# EAGLE design ZedImgBoard2 (EAGLE 6.5.0)
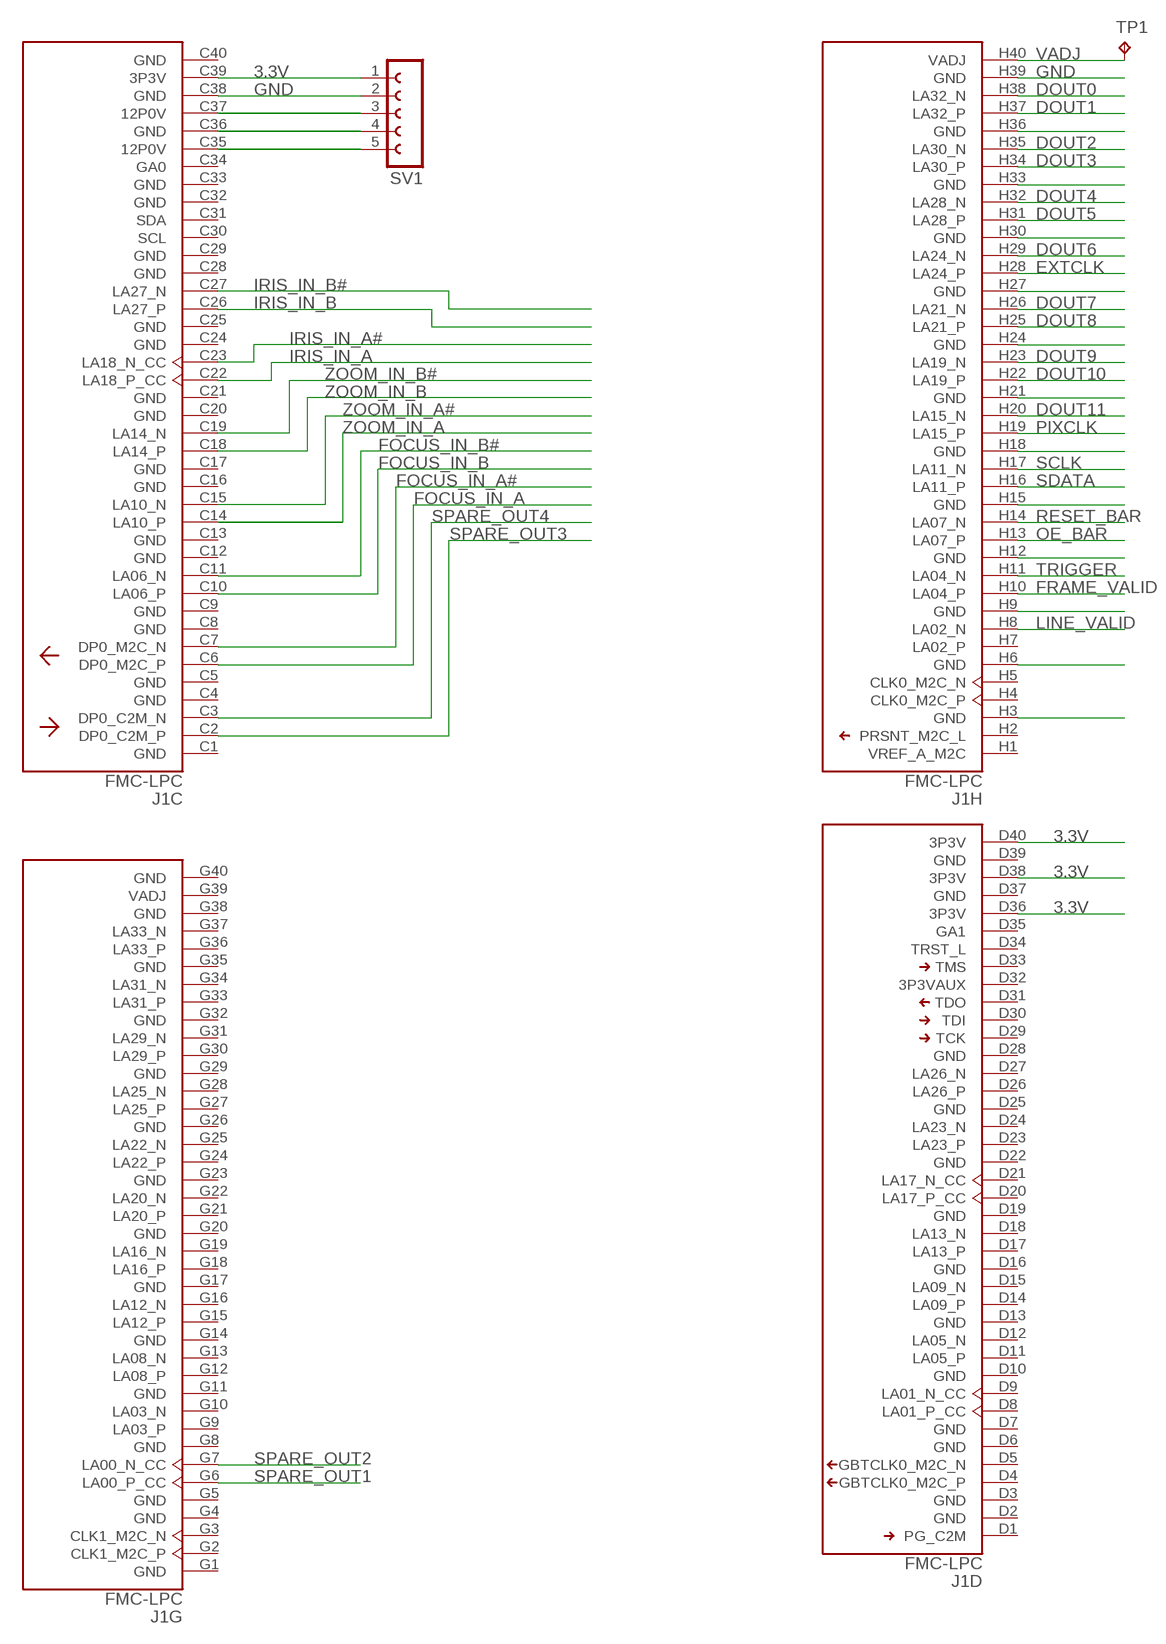
[diagram p0: schematic, sheet 1, part 1 of 2]
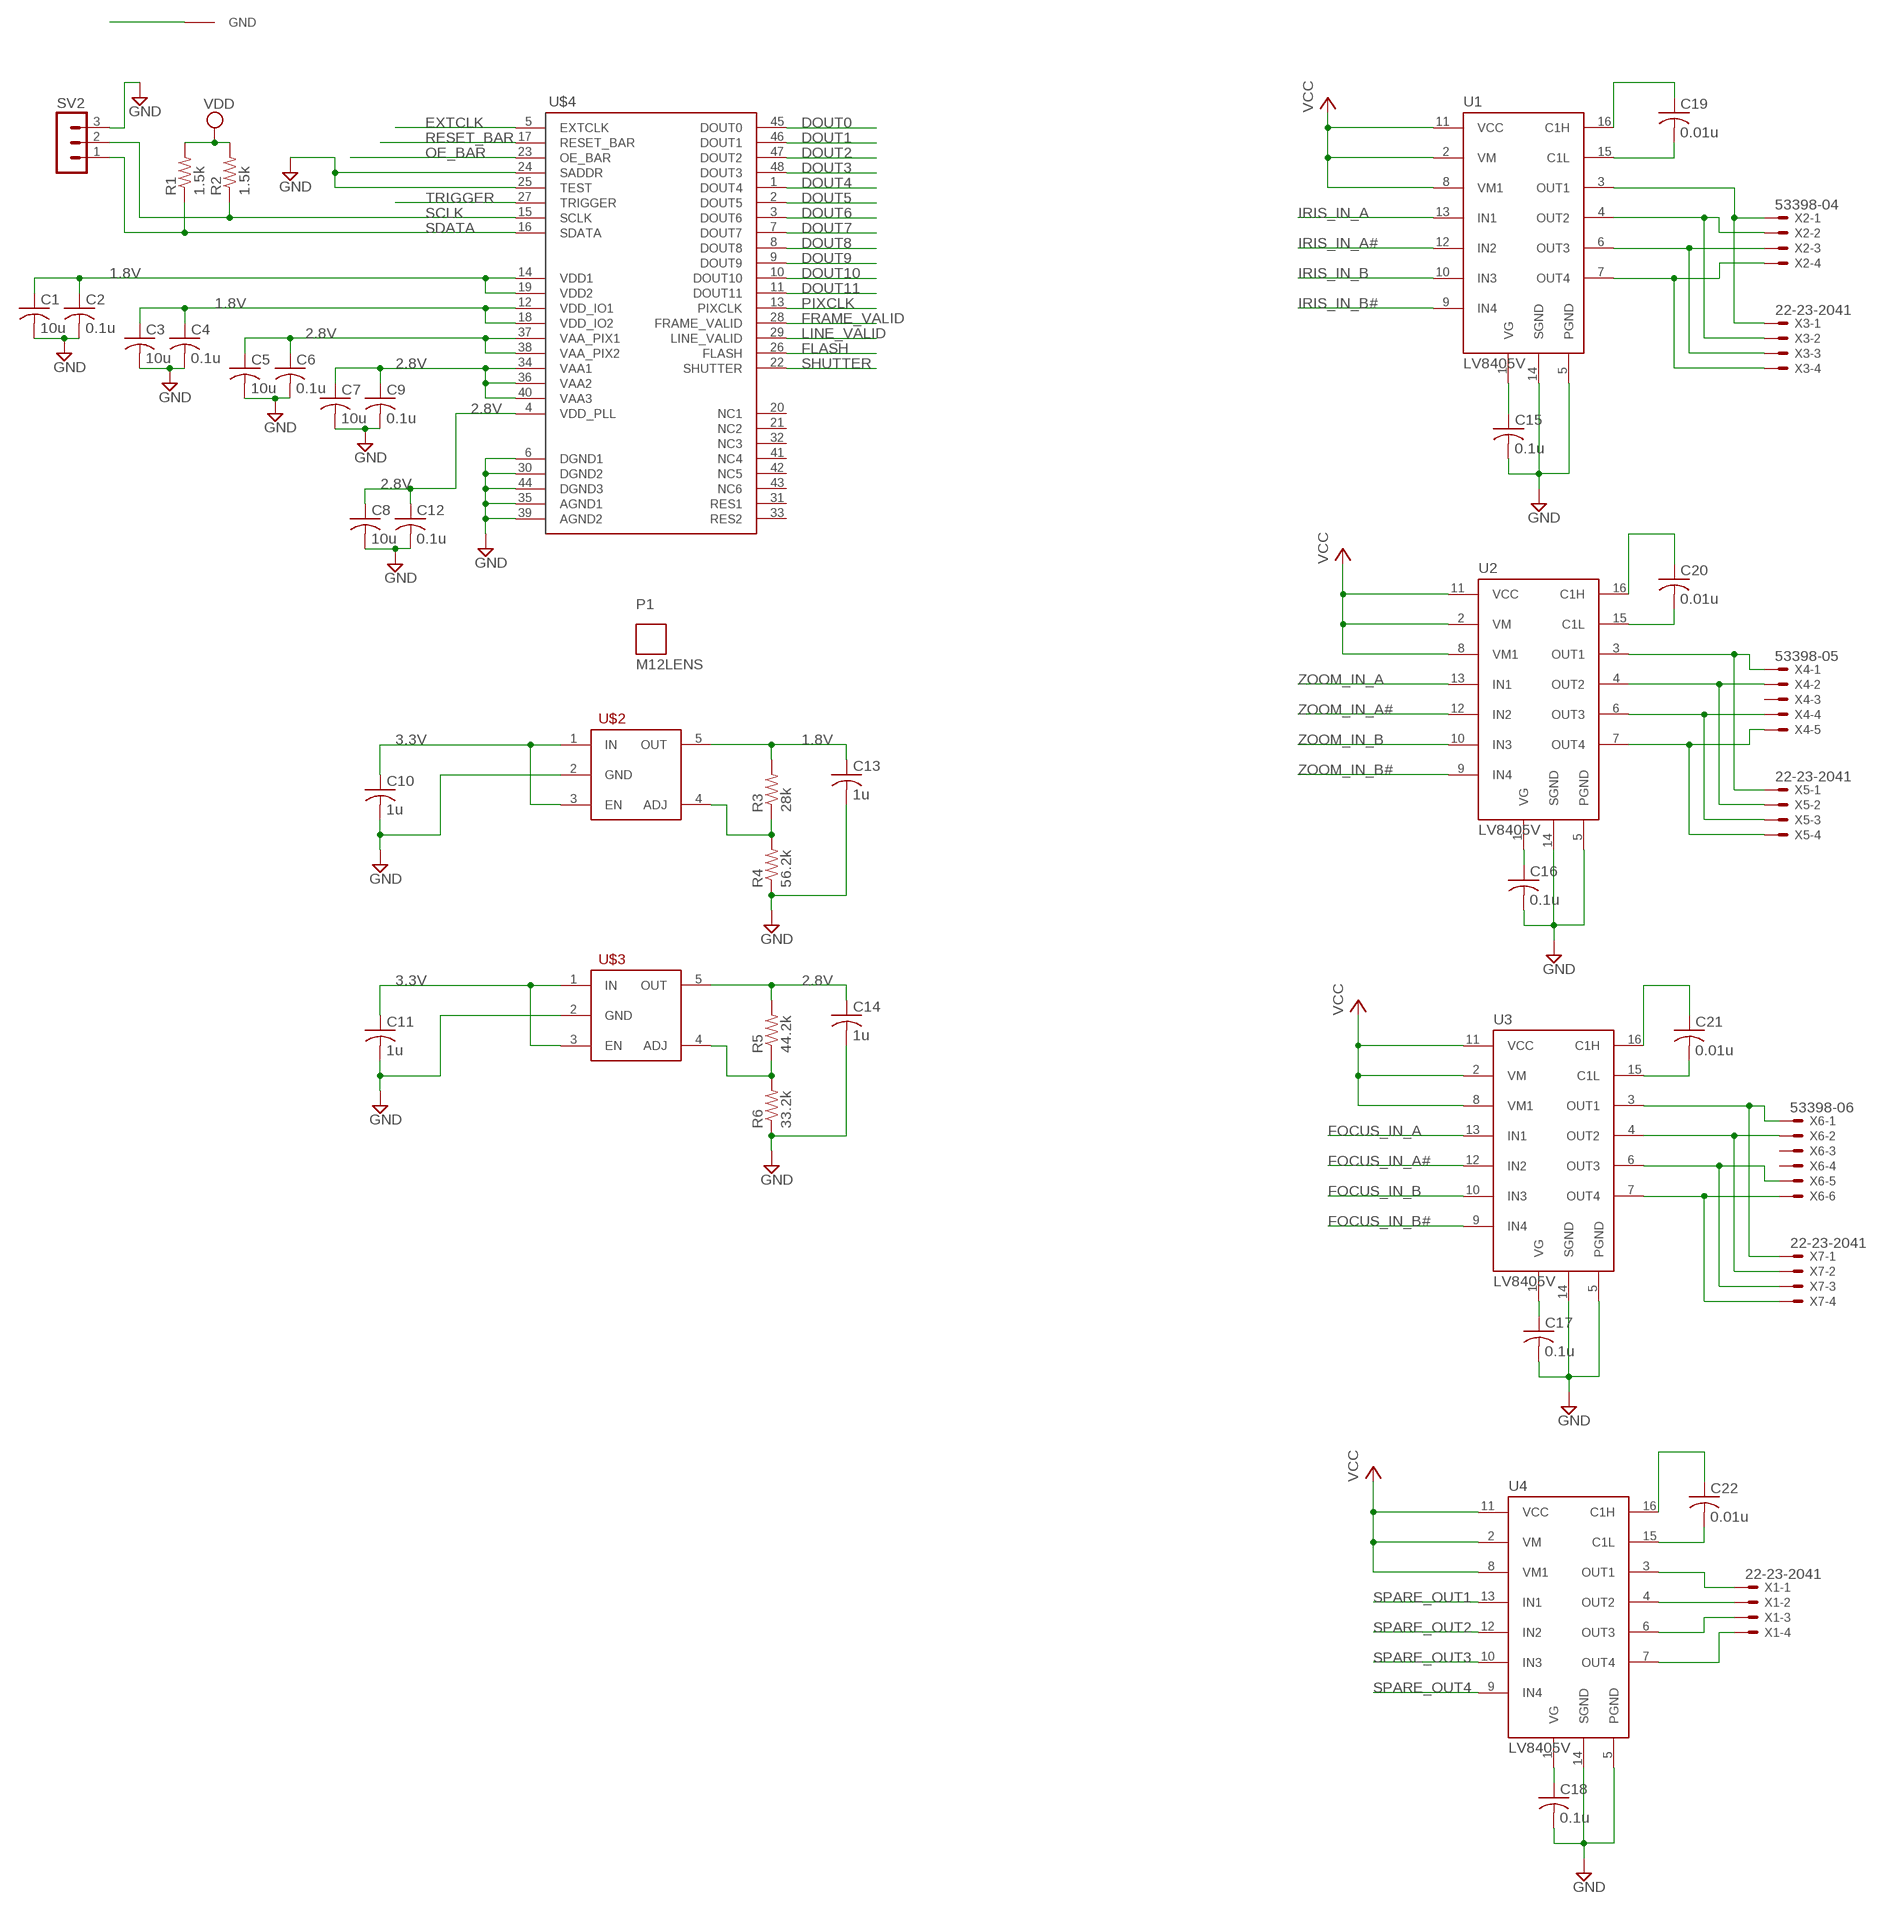
[diagram p1: schematic, sheet 1, part 2 of 2]

## Parts
C1  10u  C-USC0805  [C0805]
C2  0.1u  C-USC0805  [C0805]
C3  10u  C-USC0805  [C0805]
C4  0.1u  C-USC0805  [C0805]
C5  10u  C-USC0805  [C0805]
C6  0.1u  C-USC0805  [C0805]
C7  10u  C-USC0805  [C0805]
C8  10u  C-USC0805  [C0805]
C9  0.1u  C-USC0805  [C0805]
C10  1u  C-USC0805  [C0805]
C11  1u  C-USC0805  [C0805]
C12  0.1u  C-USC0805  [C0805]
C13  1u  C-USC0805  [C0805]
C14  1u  C-USC0805  [C0805]
C15  0.1u  C-USC0805  [C0805]
C16  0.1u  C-USC0805  [C0805]
C17  0.1u  C-USC0805  [C0805]
C18  0.1u  C-USC0805  [C0805]
C19  0.01u  C-USC0805  [C0805]
C20  0.01u  C-USC0805  [C0805]
C21  0.01u  C-USC0805  [C0805]
C22  0.01u  C-USC0805  [C0805]
J1  FMC-LPC  [FMC-LPC-MALE]
P1  M12LENS  [M12LENS]
R1  1.5k  R-US_M0805  [M0805]
R2  1.5k  R-US_M0805  [M0805]
R3  28k  R-US_M0805  [M0805]
R4  56.2k  R-US_M0805  [M0805]
R5  44.2k  R-US_M0805  [M0805]
R6  33.2k  R-US_M0805  [M0805]
SV1  FE05-1  [FE05-1]
SV2  MA03-1  [MA03-1]
TP1  TPB1,27  [B1,27]
U1  LV8405V  [SSOP16]
U2  LV8405V  [SSOP16]
U3  LV8405V  [SSOP16]
U4  LV8405V  [SSOP16]
U$1  GND_LUG  [GND_PAD]
U$2  TPS73201DB  [SOT23-5]
U$3  TPS73201DB  [SOT23-5]
U$4  AR0331  [ILCC48]
X1  22-23-2041  [22-23-2041]
X2  53398-04  [53398-04]
X3  22-23-2041  [22-23-2041]
X4  53398-05  [53398-05]
X5  22-23-2041  [22-23-2041]
X6  53398-06  [53398-06]
X7  22-23-2041  [22-23-2041]

## Nets
1.8V: C1.1 C2.1 C3.1 C4.1 C13.1 R1.2 R2.2 R3.2 U$2.5(OUT) U$4.12(VDD_IO1) U$4.14(VDD1) U$4.18(VDD_IO2) U$4.19(VDD2) ; supply symbol labelled VDD
2.8V: C5.1 C6.1 C7.1 C8.1 C9.1 C12.1 C14.1 R5.2 U$3.5(OUT) U$4.4(VDD_PLL) U$4.34(VAA1) U$4.36(VAA2) U$4.37(VAA_PIX1) U$4.38(VAA_PIX2) U$4.40(VAA3)
3.3V: C10.1 C11.1 J1.C39(C:3P3V) J1.D36(D:3P3V) J1.D38(D:3P3V) J1.D40(D:3P3V) SV1.1 U1.2(VM) U1.8(VM1) U1.11(VCC) U2.2(VM) U2.8(VM1) U2.11(VCC) U3.2(VM) U3.8(VM1) U3.11(VCC) U4.2(VM) U4.8(VM1) U4.11(VCC) U$2.1(IN) U$2.3(EN) U$3.1(IN) U$3.3(EN) ; supply symbol labelled VCC
DOUT0: J1.H38(H:LA32_N) U$4.45(DOUT0)
DOUT1: J1.H37(H:LA32_P) U$4.46(DOUT1)
DOUT2: J1.H35(H:LA30_N) U$4.47(DOUT2)
DOUT3: J1.H34(H:LA30_P) U$4.48(DOUT3)
DOUT4: J1.H32(H:LA28_N) U$4.1(DOUT4)
DOUT5: J1.H31(H:LA28_P) U$4.2(DOUT5)
DOUT6: J1.H29(H:LA24_N) U$4.3(DOUT6)
DOUT7: J1.H26(H:LA21_N) U$4.7(DOUT7)
DOUT8: J1.H25(H:LA21_P) U$4.8(DOUT8)
DOUT9: J1.H23(H:LA19_N) U$4.9(DOUT9)
DOUT10: J1.H22(H:LA19_P) U$4.10(DOUT10)
DOUT11: J1.H20(H:LA15_N) U$4.11(DOUT11)
EXTCLK: J1.H28(H:LA24_P) U$4.5(EXTCLK)
FLASH: U$4.26(FLASH)
FOCUS_IN_A: J1.C6(C:DP0_M2C_P) U3.13(IN1)
FOCUS_IN_A#: J1.C7(C:DP0_M2C_N) U3.12(IN2)
FOCUS_IN_B: J1.C10(C:LA06_P) U3.10(IN3)
FOCUS_IN_B#: J1.C11(C:LA06_N) U3.9(IN4)
FRAME_VALID: J1.H10(H:LA04_P) U$4.28(FRAME_VALID)
GND: C1.2 C2.2 C3.2 C4.2 C5.2 C6.2 C7.2 C8.2 C9.2 C10.2 C11.2 C12.2 C13.2 C14.2 C15.2 C16.2 C17.2 C18.2 J1.C38(C:GND) J1.H3(H:GND) J1.H6(H:GND) J1.H9(H:GND) J1.H12(H:GND) J1.H15(H:GND) J1.H18(H:GND) J1.H21(H:GND) J1.H24(H:GND) J1.H27(H:GND) J1.H30(H:GND) J1.H33(H:GND) J1.H36(H:GND) J1.H39(H:GND) R4.1 R6.1 SV1.2 SV2.3 U1.5(PGND) U1.14(SGND) U2.5(PGND) U2.14(SGND) U3.5(PGND) U3.14(SGND) U4.5(PGND) U4.14(SGND) U$1.P$1(GND) U$2.2(GND) U$3.2(GND) U$4.6(DGND1) U$4.24(SADDR) U$4.25(TEST) U$4.30(DGND2) U$4.35(AGND1) U$4.39(AGND2) U$4.44(DGND3)
IRIS_IN_A: J1.C22(C:LA18_P_CC) U1.13(IN1)
IRIS_IN_A#: J1.C23(C:LA18_N_CC) U1.12(IN2)
IRIS_IN_B: J1.C26(C:LA27_P) U1.10(IN3)
IRIS_IN_B#: J1.C27(C:LA27_N) U1.9(IN4)
LINE_VALID: J1.H8(H:LA02_N) U$4.29(LINE_VALID)
N$1: U1.3(OUT1) X2.1 X3.1
N$2: U1.4(OUT2) X2.2 X3.2
N$3: U1.6(OUT3) X2.3 X3.3
N$4: U2.3(OUT1) X4.1 X5.1
N$5: U2.4(OUT2) X4.2 X5.2
N$6: U2.6(OUT3) X4.4 X5.3
N$7: U2.7(OUT4) X4.5 X5.4
N$8: U3.3(OUT1) X6.1 X7.1
N$9: U3.4(OUT2) X6.2 X7.2
N$10: U3.6(OUT3) X6.5 X7.3
N$11: U3.7(OUT4) X6.6 X7.4
N$15: C19.2 U1.15(C1L)
N$16: C19.1 U1.16(C1H)
N$17: C15.1 U1.1(VG)
N$18: C20.2 U2.15(C1L)
N$19: C20.1 U2.16(C1H)
N$20: C16.1 U2.1(VG)
N$21: C21.2 U3.15(C1L)
N$22: C21.1 U3.16(C1H)
N$23: C17.1 U3.1(VG)
N$27: U1.7(OUT4) X2.4 X3.4
N$29: C22.2 U4.15(C1L)
N$36: C22.1 U4.16(C1H)
N$37: R3.1 R4.2 U$2.4(ADJ)
N$38: J1.C37(C:12P0V) SV1.3
N$39: J1.C36(C:GND) SV1.4
N$40: R5.1 R6.2 U$3.4(ADJ)
N$41: J1.C35(C:12P0V) SV1.5
N$46: C18.1 U4.1(VG)
N$47: U4.3(OUT1) X1.1
N$48: U4.4(OUT2) X1.2
N$49: U4.6(OUT3) X1.3
N$50: U4.7(OUT4) X1.4
OE_BAR: J1.H13(H:LA07_P) U$4.23(OE_BAR)
PIXCLK: J1.H19(H:LA15_P) U$4.13(PIXCLK)
RESET_BAR: J1.H14(H:LA07_N) U$4.17(RESET_BAR)
SCLK: J1.H17(H:LA11_N) R2.1 SV2.2 U$4.15(SCLK)
SDATA: J1.H16(H:LA11_P) R1.1 SV2.1 U$4.16(SDATA)
SHUTTER: U$4.22(SHUTTER)
SPARE_OUT1: J1.G6(G:LA00_P_CC) U4.13(IN1)
SPARE_OUT2: J1.G7(G:LA00_N_CC) U4.12(IN2)
SPARE_OUT3: J1.C2(C:DP0_C2M_P) U4.10(IN3)
SPARE_OUT4: J1.C3(C:DP0_C2M_N) U4.9(IN4)
TRIGGER: J1.H11(H:LA04_N) U$4.27(TRIGGER)
VADJ: J1.H40(H:VADJ) TP1.TP
ZOOM_IN_A: J1.C14(C:LA10_P) U2.13(IN1)
ZOOM_IN_A#: J1.C15(C:LA10_N) U2.12(IN2)
ZOOM_IN_B: J1.C18(C:LA14_P) U2.10(IN3)
ZOOM_IN_B#: J1.C19(C:LA14_N) U2.9(IN4)
Unconnected: J1.C1(C:GND) J1.C4(C:GND) J1.C5(C:GND) J1.C8(C:GND) J1.C9(C:GND) J1.C12(C:GND) J1.C13(C:GND) J1.C16(C:GND) J1.C17(C:GND) J1.C20(C:GND) J1.C21(C:GND) J1.C24(C:GND) J1.C25(C:GND) J1.C28(C:GND) J1.C29(C:GND) J1.C30(C:SCL) J1.C31(C:SDA) J1.C32(C:GND) J1.C33(C:GND) J1.C34(C:GA0) J1.C40(C:GND) J1.D1(D:PG_C2M) J1.D2(D:GND) J1.D3(D:GND) J1.D4(D:GBTCLK0_M2C_P) J1.D5(D:GBTCLK0_M2C_N) J1.D6(D:GND) J1.D7(D:GND) J1.D8(D:LA01_P_CC) J1.D9(D:LA01_N_CC) J1.D10(D:GND) J1.D11(D:LA05_P) J1.D12(D:LA05_N) J1.D13(D:GND) J1.D14(D:LA09_P) J1.D15(D:LA09_N) J1.D16(D:GND) J1.D17(D:LA13_P) J1.D18(D:LA13_N) J1.D19(D:GND) J1.D20(D:LA17_P_CC) J1.D21(D:LA17_N_CC) J1.D22(D:GND) J1.D23(D:LA23_P) J1.D24(D:LA23_N) J1.D25(D:GND) J1.D26(D:LA26_P) J1.D27(D:LA26_N) J1.D28(D:GND) J1.D29(D:TCK) J1.D30(D:TDI) J1.D31(D:TDO) J1.D32(D:3P3VAUX) J1.D33(D:TMS) J1.D34(D:TRST_L) J1.D35(D:GA1) J1.D37(D:GND) J1.D39(D:GND) J1.G1(G:GND) J1.G2(G:CLK1_M2C_P) J1.G3(G:CLK1_M2C_N) J1.G4(G:GND) J1.G5(G:GND) J1.G8(G:GND) J1.G9(G:LA03_P) J1.G10(G:LA03_N) J1.G11(G:GND) J1.G12(G:LA08_P) J1.G13(G:LA08_N) J1.G14(G:GND) J1.G15(G:LA12_P) J1.G16(G:LA12_N) J1.G17(G:GND) J1.G18(G:LA16_P) J1.G19(G:LA16_N) J1.G20(G:GND) J1.G21(G:LA20_P) J1.G22(G:LA20_N) J1.G23(G:GND) J1.G24(G:LA22_P) J1.G25(G:LA22_N) J1.G26(G:GND) J1.G27(G:LA25_P) J1.G28(G:LA25_N) J1.G29(G:GND) J1.G30(G:LA29_P) J1.G31(G:LA29_N) J1.G32(G:GND) J1.G33(G:LA31_P) J1.G34(G:LA31_N) J1.G35(G:GND) J1.G36(G:LA33_P) J1.G37(G:LA33_N) J1.G38(G:GND) J1.G39(G:VADJ) J1.G40(G:GND) J1.H1(H:VREF_A_M2C) J1.H2(H:PRSNT_M2C_L) J1.H4(H:CLK0_M2C_P) J1.H5(H:CLK0_M2C_N) J1.H7(H:LA02_P) U$4.20(NC1) U$4.21(NC2) U$4.31(RES1) U$4.32(NC3) U$4.33(RES2) U$4.41(NC4) U$4.42(NC5) U$4.43(NC6) X4.3 X6.3 X6.4

## Library data of the parts
C1-C22 = resistor:C-US: CAPACITOR, American symbol
J1 = dan-xilinx:FMC-LPC: FMC-LPC Bottom side connector for interfacing with Xilinx FPGA development boards (e.g. SP605); OC_NEWARK: unknown
P1 = NicksParts:M12LENS
R1-R6 = resistor:R-US_: RESISTOR, American symbol
SV1 = con-lsta:FE05-1: FEMALE HEADER; OC_FARNELL: unknown; OC_NEWARK: unknown
SV2 = con-lstb:MA03-1: PIN HEADER; OC_FARNELL: unknown; OC_NEWARK: unknown
TP1 = testpad:TP: Test pad
U1-U4 = NicksParts:LV8405V
U$1 = NicksParts:GND_LUG
U$2 U$3 = NicksParts:TPS73201DB
U$4 = NicksParts:AR0331
X1 X3 X5 X7 = con-molex:22-23-2041: .100" (2.54mm) Center Header - 4 Pin; MF: MOLEX; MPN: 22-23-2041; OC_FARNELL: 1462920; OC_NEWARK: 38C0355
X2 = con-molex:53?-04: CONNECTOR wire to board 1.25 mm (.049 inch) pitch header; OC_FARNELL: 1125367; OC_NEWARK: unknown
X4 = con-molex:53?-05: CONNECTOR wire to board 1.25 mm (.049 inch) pitch header; OC_FARNELL: 1125354; OC_NEWARK: unknown
X6 = con-molex:53?-06: CONNECTOR wire to board 1.25 mm (.049 inch) pitch header; OC_FARNELL: 1125368; OC_NEWARK: unknown

## Board
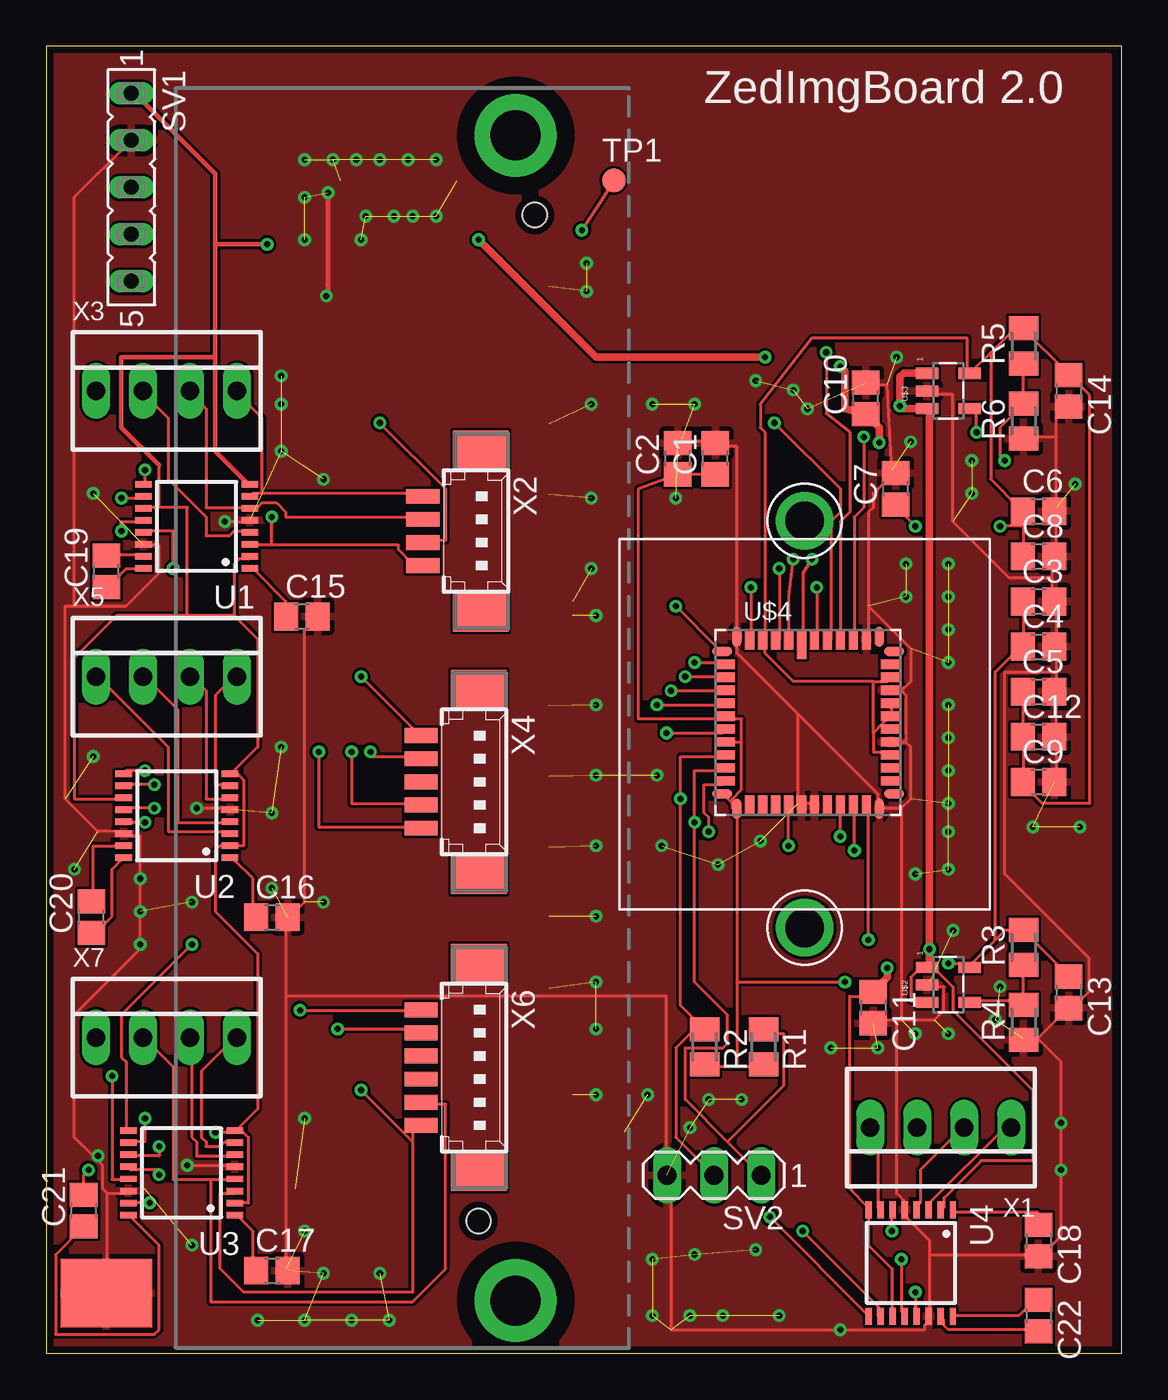
[diagram p2: board, top side]
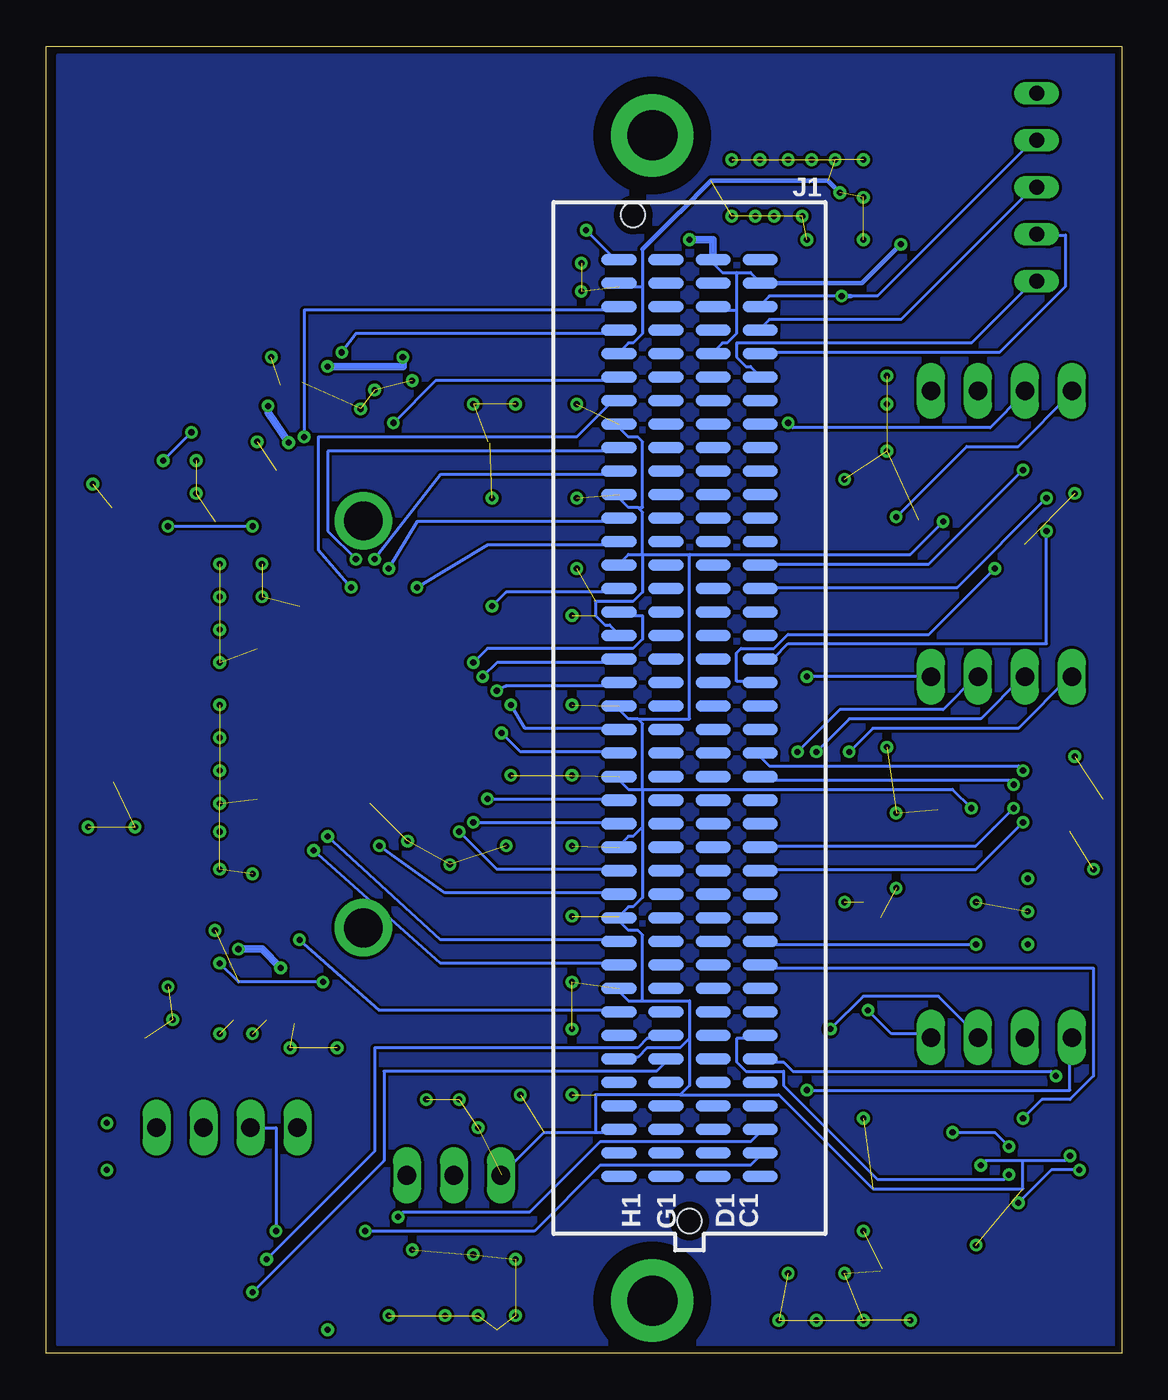
[diagram p3: board, bottom side, seen from below]

Size 58.14 x 70.65 mm. Coordinates in mm from the lower left corner, seen from the top.
Outline: 0,0 58.14,0 58.14,70.65 0,70.65 0,0
Copper layers (1*16): Top 0.0356mm / dielectric 1.5011mm / Bottom 0.0356mm
Design rules "LaenPCBOrder": minimum track width 6mil, minimum drill 13mil, track to track 6mil, track to pad 6mil, pad to pad 6mil, via to via 6mil, smd to smd 6mil, copper to edge 15mil, drill to drill 6mil, minimum pad ring 7mil, minimum via ring 7mil, stop-mask expansion 3mil, vias tented up to drill 0mil, thermal gap 10mil

### Footprints (pad centres in the part's own frame; a part is rotated, then mirrored left to right if it is on the bottom)
C0805 = smd 1.3 x 1.5: 1 -0.85,0; 2 0.85,0
FMC-LPC-MALE = smd 1.905 x 0.635 bottom: C1 -3.81,-24.765; C2 -3.81,-23.495; C3 -3.81,-22.225; C4 -3.81,-20.955; C5 -3.81,-19.685; C6 -3.81,-18.415; C7 -3.81,-17.145; C8 -3.81,-15.875; C9 -3.81,-14.605; C10 -3.81,-13.335; C11 -3.81,-12.065; C12 -3.81,-10.795; C13 -3.81,-9.525; C14 -3.81,-8.255; C15 -3.81,-6.985; C16 -3.81,-5.715; C17 -3.81,-4.445; C18 -3.81,-3.175; C19 -3.81,-1.905; C20 -3.81,-0.635; C21 -3.81,0.635; C22 -3.81,1.905; C23 -3.81,3.175; C24 -3.81,4.445; C25 -3.81,5.715; C26 -3.81,6.985; C27 -3.81,8.255; C28 -3.81,9.525; C29 -3.81,10.795; C30 -3.81,12.065; C31 -3.81,13.335; C32 -3.81,14.605; C33 -3.81,15.875; C34 -3.81,17.145; C35 -3.81,18.415; C36 -3.81,19.685; C37 -3.81,20.955; C38 -3.81,22.225; C39 -3.81,23.495; C40 -3.81,24.765; D1 -1.27,-24.765; D2 -1.27,-23.495; D3 -1.27,-22.225; D4 -1.27,-20.955; D5 -1.27,-19.685; D6 -1.27,-18.415; D7 -1.27,-17.145; D8 -1.27,-15.875; D9 -1.27,-14.605; D10 -1.27,-13.335; D11 -1.27,-12.065; D12 -1.27,-10.795; D13 -1.27,-9.525; D14 -1.27,-8.255; D15 -1.27,-6.985; D16 -1.27,-5.715; D17 -1.27,-4.445; D18 -1.27,-3.175; D19 -1.27,-1.905; D20 -1.27,-0.635; D21 -1.27,0.635; D22 -1.27,1.905; D23 -1.27,3.175; D24 -1.27,4.445; D25 -1.27,5.715; D26 -1.27,6.985; D27 -1.27,8.255; D28 -1.27,9.525; D29 -1.27,10.795; D30 -1.27,12.065; D31 -1.27,13.335; D32 -1.27,14.605; D33 -1.27,15.875; D34 -1.27,17.145; D35 -1.27,18.415; D36 -1.27,19.685; D37 -1.27,20.955; D38 -1.27,22.225; D39 -1.27,23.495; D40 -1.27,24.765; G1 1.27,-24.765; G2 1.27,-23.495; G3 1.27,-22.225; G4 1.27,-20.955; G5 1.27,-19.685; G6 1.27,-18.415; G7 1.27,-17.145; G8 1.27,-15.875; G9 1.27,-14.605; G10 1.27,-13.335; G11 1.27,-12.065; G12 1.27,-10.795; G13 1.27,-9.525; G14 1.27,-8.255; G15 1.27,-6.985; G16 1.27,-5.715; G17 1.27,-4.445; G18 1.27,-3.175; G19 1.27,-1.905; G20 1.27,-0.635; G21 1.27,0.635; G22 1.27,1.905; G23 1.27,3.175; G24 1.27,4.445; G25 1.27,5.715; G26 1.27,6.985; G27 1.27,8.255; G28 1.27,9.525; G29 1.27,10.795; G30 1.27,12.065; G31 1.27,13.335; G32 1.27,14.605; G33 1.27,15.875; G34 1.27,17.145; G35 1.27,18.415; G36 1.27,19.685; G37 1.27,20.955; G38 1.27,22.225; G39 1.27,23.495; G40 1.27,24.765; H1 3.81,-24.765; H2 3.81,-23.495; H3 3.81,-22.225; H4 3.81,-20.955; H5 3.81,-19.685; H6 3.81,-18.415; H7 3.81,-17.145; H8 3.81,-15.875; H9 3.81,-14.605; H10 3.81,-13.335; H11 3.81,-12.065; H12 3.81,-10.795; H13 3.81,-9.525; H14 3.81,-8.255; H15 3.81,-6.985; H16 3.81,-5.715; H17 3.81,-4.445; H18 3.81,-3.175; H19 3.81,-1.905; H20 3.81,-0.635; H21 3.81,0.635; H22 3.81,1.905; H23 3.81,3.175; H24 3.81,4.445; H25 3.81,5.715; H26 3.81,6.985; H27 3.81,8.255; H28 3.81,9.525; H29 3.81,10.795; H30 3.81,12.065; H31 3.81,13.335; H32 3.81,14.605; H33 3.81,15.875; H34 3.81,17.145; H35 3.81,18.415; H36 3.81,19.685; H37 3.81,20.955; H38 3.81,22.225; H39 3.81,23.495; H40 3.81,24.765 | drill 2.692 pad 4.445: M1 2.007,31.496; M2 2.007,-31.496 | hole 1.321: 0,-27.191; 3.048,27.191
M12LENS = drill 2.1 pad 3: P$1 11,0; P$3 -11,0
M0805 = smd 1.3 x 1.6: 1 -0.95,0; 2 0.95,0
FE05-1 = drill 0.813 long: 1 -5.08,0; 2 -2.54,0; 3 0,0; 4 2.54,0; 5 5.08,0
MA03-1 = drill 1.016 long: 1 -2.54,0; 2 0,0; 3 2.54,0
B1,27 = smd 1.27 x 1.27: TP 0,0
SSOP16 = smd 0.9 x 0.35: 1 -2.875,2.275; 2 -2.875,1.625; 3 -2.875,0.975; 4 -2.875,0.325; 5 -2.875,-0.325; 6 -2.875,-0.975; 7 -2.875,-1.625; 8 -2.875,-2.275; 9 2.875,-2.275; 10 2.875,-1.625; 11 2.875,-0.975; 12 2.875,-0.325; 13 2.875,0.325; 14 2.875,0.975; 15 2.875,1.625; 16 2.875,2.275
GND_PAD = smd 4.953 x 3.683: P$1 0,0
SOT23-5 = smd 0.6 x 1.2: 1 0.95,1.15; 2 0,1.15; 3 -0.95,1.15; 4 -0.95,-1.15; 5 0.95,-1.15
ILCC48 = smd 0.5 x 1.6: 1 -0.35,4.25 | smd 0.5 x 1.1: 2 -1.05,4.5; 3 -1.75,4.5; 4 -2.45,4.5; 5 -3.15,4.5; 6 -3.85,4.65; 19 -3.85,-4.65; 20 -3.15,-4.5; 21 -2.45,-4.5; 22 -1.75,-4.5; 23 -1.05,-4.5; 24 -0.35,-4.5; 25 0.35,-4.5; 26 1.05,-4.5; 27 1.75,-4.5; 28 2.45,-4.5; 29 3.15,-4.5; 30 3.85,-4.65; 43 3.85,4.65; 44 3.15,4.5; 45 2.45,4.5; 46 1.75,4.5; 47 1.05,4.5; 48 0.35,4.5 | smd 1.1 x 0.5: 7 -4.65,3.85; 8 -4.5,3.15; 9 -4.5,2.45; 10 -4.5,1.75; 11 -4.5,1.05; 12 -4.5,0.35; 13 -4.5,-0.35; 14 -4.5,-1.05; 15 -4.5,-1.75; 16 -4.5,-2.45; 17 -4.5,-3.15; 18 -4.65,-3.85; 31 4.65,-3.85; 32 4.5,-3.15; 33 4.5,-2.45; 34 4.5,-1.75; 35 4.5,-1.05; 36 4.5,-0.35; 37 4.5,0.35; 38 4.5,1.05; 39 4.5,1.75; 40 4.5,2.45; 41 4.5,3.15; 42 4.65,3.85
22-23-2041 = drill 1 long: 1 -3.81,0; 2 -1.27,0; 3 1.27,0; 4 3.81,0
53398-04 = smd 0.8 x 1.8: 1 1.875,-2.5; 2 0.625,-2.5; 3 -0.625,-2.5; 4 -1.875,-2.5 | smd 2.1 x 3: S1 4.375,0.625; S2 -4.375,0.625
53398-05 = smd 0.8 x 1.8: 1 2.5,-2.5; 2 1.25,-2.5; 3 0,-2.5; 4 -1.25,-2.5; 5 -2.5,-2.5 | smd 2.1 x 3: S1 5,0.625; S2 -5,0.625
53398-06 = smd 0.8 x 1.8: 1 3.125,-2.5; 2 1.875,-2.5; 3 0.625,-2.5; 4 -0.625,-2.5; 5 -1.875,-2.5; 6 -3.125,-2.5 | smd 2.1 x 3: S1 5.625,0.625; S2 -5.625,0.625

### Placement (x,y rotation side)
C1  36.17,48.36 90 top
C2  34.14,48.36 90 top
C3  53.64,40.64 0 top
C4  53.64,38.2 0 top
C5  53.64,35.76 0 top
C6  53.64,45.52 0 top
C7  45.92,46.74 90 top
C8  53.64,43.08 0 top
C9  53.64,30.89 0 top
C10  44.3,51.61 90 top
C11  44.7,18.69 270 top
C12  53.64,33.32 0 top
C13  55.27,19.51 270 top
C14  55.27,52.02 270 top
C15  13.82,39.83 0 top
C16  12.19,23.57 0 top
C17  12.19,4.47 0 top
C18  53.64,6.1 270 top
C19  3.25,42.27 90 top
C20  2.44,23.57 90 top
C21  2.03,7.72 90 top
C22  53.64,2.03 270 top
J1  23.37,34.34 0 top
P1  41,34 90 top
R1  38.78,16.56 270 top
R2  35.59,16.56 270 top
R3  52.83,21.95 90 top
R4  52.83,17.88 90 top
R5  52.83,54.46 90 top
R6  52.83,50.39 90 top
SV1  4.6,63.03 270 top
SV2  36.1,9.62 180 top
TP1  30.68,63.4 0 top
U1  8.13,44.7 180 top
U2  7.06,29.06 180 top
U3  7.32,9.75 180 top
U4  46.74,4.88 270 top
U$1  3.25,3.25 0 top
U$2  48.77,19.91 90 top
U$3  48.77,52.02 90 top
U$4  41.18,34.09 0 top
X1  48.36,12.19 180 top
X2  22.86,44.45 270 top
X3  6.5,52.02 0 top
X4  22.76,30.89 270 top
X5  6.5,36.58 0 top
X6  22.76,15.44 270 top
X7  6.5,17.07 0 top

### Tracks (layer width: path | path; a pad name or v marks a point on that pad's centre or on a via)
1.8V  (via drill 0.33)
  Top 0.152: C3.1 52.83,40.64 52.83,38.35 C4.1 52.58,38.1 51.31,36.83 51.31,22.35 | 51.31,22.35 51.82,22.86 52.83,22.86 | 51.31,22.35 50.04,21.08 U$2.5 49.78,21.08 v48.77,21.08 | 52.83,22.86 55.12,20.57 C13.1 | 52.83,22.86 R3.2 | 37.34,15.49 38.61,15.49 R1.2 | 37.34,15.49 35.81,15.49 R2.2 | C1.1 36.07,47.5 34.29,47.5 C2.1 34.04,47.5 32,46.74 32,34.29 36.58,34.29 U$4.12 36.83,34.29 37.59,34.29 37.59,33.02 | 37.08,29.72 36.58,30.23 U$4.18 | 37.08,29.72 37.08,29.46 U$4.19 | 37.59,33.02 36.83,33.02 U$4.14 | 37.59,33.02 37.59,30.48 37.08,29.97 37.08,29.72 | 37.08,29.72 U$4.19 | 37.34,20.07 37.34,29.21 U$4.19 | 37.34,20.07 37.34,15.49 | 37.34,20.07 v43.18,20.07
  Bottom 0.152: v48.77,21.08 47.75,20.07 v43.18,20.07
2.8V  (via drill 0.33)
  Top 0.152: 44.7,33.53 44.7,32.51 45.47,32.51 U$4.34 | 45.21,34.04 45.47,34.29 U$4.37 45.72,34.54 45.72,35.05 U$4.38 | 45.21,34.04 44.7,33.53 | 45.21,34.04 45.47,33.78 U$4.36 | 44.7,36.32 45.47,36.32 U$4.40 | 44.7,33.53 44.7,36.32 | 44.7,36.32 40.39,36.32 38.86,37.85 38.86,38.35 U$4.4 38.86,38.61 38.86,49.78 38.61,50.04 38.61,51.31 41.4,54.86 49.78,54.86 49.78,53.09 U$3.5 50.04,53.09 51.05,54.1 | 52.83,44.7 52.83,45.47 C6.1 52.58,45.72 51.05,47.24 51.05,54.1 | 52.83,44.7 52.83,43.18 C8.1 | v46.99,44.7 45.97,45.72 C7.1 | 52.83,44.7 v51.56,44.7 | C5.1 52.83,35.56 52.83,33.53 C12.1 52.83,33.27 52.83,30.99 C9.1 52.83,30.73 53.85,29.72 56.39,29.72 56.39,51.82 55.37,52.83 C14.1 55.12,53.09 52.83,55.37 | 51.05,54.1 52.32,55.37 52.83,55.37 | 52.83,55.37 R5.2
  Bottom 0.152: v51.56,44.7 v46.99,44.7
3.3V  (via drill 0.33, 0.33 pad 0.25)
  Top 0.152: U4.11 45.72,2.03 45.72,4.57 44.45,5.84 44.45,7.62 U4.8 44.45,7.87 43.43,8.89 43.43,19.3 44.7,19.3 C11.1 44.7,19.56 | 47.5,51.05 U$3.3 47.75,51.05 | 47.5,52.83 U$3.1 | 44.2,50.8 C10.1 | U4.2 48.51,7.87 48.51,8.38 50.55,10.41 53.34,10.41 53.34,14.22 49.02,18.54 49.02,19.81 47.75,21.08 U$2.1 47.5,21.08 46.74,20.32 46.74,19.05 47.5,19.05 U$2.3 | 10.92,46.99 U1.8 | 4.83,68.07 SV1.1 | v6.1,11.18 6.1,10.67 4.57,10.67 U3.11 | v9.14,11.94 10.16,11.94 U3.8 10.41,12.19 | 10.41,12.19 10.92,11.68 10.92,8.13 10.41,8.13 U3.2 | 10.16,31.5 10.67,30.99 10.67,27.43 10.16,27.43 U2.2 9.91,27.43 9.4,27.43 9.14,27.18 9.14,23.88 11.43,21.59 11.43,13.21 10.41,12.19 | 10.16,39.88 7.62,39.88 | 7.62,39.88 3.81,39.88 1.52,37.59 1.52,29.97 4.06,29.97 U2.11 | 10.16,39.88 10.16,42.67 10.41,42.93 10.92,42.93 U1.2 | 6.1,45.72 7.62,45.72 7.62,39.88 | 6.1,45.72 5.33,45.72 U1.11 | 10.16,31.5 11.43,32.77 11.43,38.61 10.16,39.88 | 10.16,31.5 U2.8 | 6.1,45.72 6.1,48.01
  Top 0.254: 10.92,46.99 9.14,48.77 9.14,53.85 | 9.14,59.94 9.14,63.75 4.83,68.07 | 9.14,59.94 9.14,53.85 | 9.14,53.85 4.06,53.85 4.06,50.04 6.1,48.01 | v11.94,59.94 9.14,59.94
  Top 0.406: 44.2,50.8 43.18,51.05 43.18,53.09 v42.93,53.34 | 47.75,21.08 v47.75,21.84 47.75,51.05 | 44.7,19.56 45.47,20.32 v45.47,20.83 | v38.86,53.85 29.72,53.85 v23.37,60.2 | 47.5,51.05 46.3,51.05 v46.15,51.21 46.15,52.78 46.35,52.98 47.6,52.98 U$3.1 | v45.03,49.23 45.03,50.03 C10.1
  Bottom 0.152: 20.83,56.39 22.1,56.39 J1.D38 | 20.83,58.42 21.59,58.42 22.1,58.93 J1.D40 | 20.83,58.42 20.07,58.42 19.56,57.91 J1.C39 | 20.83,58.42 20.83,56.39 | v6.1,11.18 6.86,11.94 v9.14,11.94 | 22.1,53.85 J1.D36 22.1,54.1 21.59,54.61 21.34,54.61 20.83,55.12 20.83,56.39
  Bottom 0.254: J1.C39 14.05,57.84 v11.94,59.94
  Bottom 0.406: v45.47,20.83 46.48,21.84 v47.75,21.84 | v42.93,53.34 38.86,53.34 v38.86,53.85 | v23.37,60.2 22.1,60.2 J1.D40 | v46.15,51.21 46.15,50.85 v45.03,49.23
DOUT0  (via drill 0.33)
  Top 0.152: v44.2,49.53 44.2,45.72 43.69,45.21 43.69,38.61 U$4.45
  Bottom 0.152: v44.2,49.53 44.2,56.39 27.18,56.39 J1.H38
DOUT1  (via drill 0.33)
  Top 0.152: v42.16,54.1 42.16,50.8 43.43,49.78 43.43,45.47 42.93,44.96 42.93,38.61 U$4.46
  Bottom 0.152: v42.16,54.1 41.4,55.12 27.18,55.12 J1.H37
DOUT2  (via drill 0.33)
  Top 0.152: v39.37,50.29 42.93,46.74 42.93,45.47 42.42,44.96 42.42,38.61 U$4.47
  Bottom 0.152: v39.37,50.29 37.08,52.58 27.18,52.58 J1.H35
DOUT3  (via drill 0.33)
  Top 0.152: v41.66,41.4 41.66,38.61 U$4.48
  Bottom 0.152: v41.66,41.4 43.43,43.43 43.43,49.53 29.46,49.53 27.69,51.31 27.18,51.31 J1.H34
DOUT4  (via drill 0.33)
  Top 0.152: v41.4,42.93 40.89,42.16 40.89,38.35 U$4.1
  Bottom 0.152: v41.4,42.93 42.93,44.45 42.93,48.77 27.18,48.77 J1.H32
DOUT5  (via drill 0.33)
  Top 0.152: v40.39,42.93 40.39,43.18 40.13,40.89 40.13,38.61 U$4.2
  Bottom 0.152: v40.39,42.93 36.83,47.5 27.18,47.5 J1.H31
DOUT6  (via drill 0.33)
  Top 0.152: v39.62,42.42 39.62,38.61 U$4.3
  Bottom 0.152: v39.62,42.42 38.1,44.96 27.18,44.96 J1.H29
DOUT7  (via drill 0.33)
  Top 0.152: v34.04,40.39 36.32,38.1 U$4.7
  Bottom 0.152: v34.04,40.39 33.27,41.15 27.18,41.15 J1.H26
DOUT8  (via drill 0.33)
  Top 0.152: v35.05,37.34 36.58,37.34 U$4.8
  Bottom 0.152: v35.05,37.34 34.29,38.1 26.42,38.1 25.91,38.61 25.91,39.88 27.18,39.88 J1.H25
DOUT9  (via drill 0.33)
  Top 0.152: v34.54,36.58 36.58,36.58 U$4.9
  Bottom 0.152: v34.54,36.58 33.78,37.34 27.18,37.34 J1.H23
DOUT10  (via drill 0.33)
  Top 0.152: v33.78,35.81 36.58,35.81 U$4.10
  Bottom 0.152: v33.78,35.81 33.27,36.07 27.18,36.07 J1.H22
DOUT11  (via drill 0.33)
  Top 0.152: v33.02,35.05 36.58,35.05 U$4.11
  Bottom 0.152: v33.02,35.05 32.26,33.78 27.18,33.78 J1.H20
EXTCLK  (via drill 0.33)
  Top 0.152: v38.1,41.4 38.1,38.61 U$4.5
  Bottom 0.152: v38.1,41.4 34.29,43.69 27.18,43.69 J1.H28
FOCUS_IN_A  (via drill 0.33)
  Top 0.152: v3.56,14.99 3.56,9.4 4.32,9.4 U3.13
  Bottom 0.152: v3.56,14.99 3.81,15.24 17.78,15.24 18.29,15.75 19.56,15.75 J1.C6
FOCUS_IN_A#  (via drill 0.33)
  Top 0.152: v6.1,9.65 6.1,9.91 4.57,9.91 U3.12
  Bottom 0.152: v6.1,9.65 6.35,9.4 13.21,9.4 18.29,14.48 18.29,15.24 20.32,15.24 20.83,15.75 20.83,17.02 19.56,17.02 J1.C7
FOCUS_IN_B  (via drill 0.33)
  Top 0.152: v5.33,12.7 5.33,11.43 4.57,11.43 U3.10
  Bottom 0.152: v5.33,12.7 4.32,13.72 2.79,13.72 1.52,14.99 1.52,20.83 19.56,20.83 J1.C10
FOCUS_IN_B#  (via drill 0.33)
  Top 0.152: v7.87,22.1 4.06,18.29 4.06,16 4.32,15.75 4.32,12.19 U3.9
  Bottom 0.152: v7.87,22.1 19.56,22.1 J1.C11
FRAME_VALID  (via drill 0.33)
  Top 0.152: v43.69,27.18 43.69,29.46 U$4.28
  Bottom 0.152: v43.69,27.18 36.83,21.08 27.18,21.08 J1.H10
GND  (via drill 0.33, 0.33 pad 0.25)  (95 unrouted)
  Top 0.152: 3.3,8.64 4.32,8.64 U3.14 | 3.3,8.64 3.3,3.3 U$1.P$1 | 2.54,10.67 3.05,10.16 3.05,8.89 3.3,8.64 | 2.54,10.67 1.52,11.68 1.52,18.29 5.08,21.84 v5.08,22.1 v5.08,23.88 v5.08,25.65 5.08,27.94 4.32,27.94 U2.14 4.06,28.19 2.79,28.19 1.02,29.97 1.02,40.39 1.52,40.39 | v7.62,10.16 10.16,10.16 U3.5 | 2.54,10.67 v2.79,10.67 | 1.52,40.39 4.32,40.39 6.1,42.16 6.1,43.69 5.33,43.69 U1.14 | 1.52,40.39 1.52,62.48 4.57,65.53 SV1.2 | C9.2 54.61,30.99 54.61,33.27 C12.2 54.61,33.53 54.61,35.56 C5.2 54.61,35.81 54.61,36.83 | 47.75,52.07 U$3.2 47.75,51.82 49.02,51.82 49.02,44.96 52.07,41.91 54.36,41.91 | 54.36,41.91 54.36,42.93 C8.2 54.61,43.18 54.61,45.47 C6.2 54.61,45.72 54.61,49.53 | 54.61,49.53 54.61,50.55 55.12,51.05 C14.2 | 54.61,49.53 52.83,49.53 R6.1 | 54.36,41.91 54.36,40.64 C3.2 54.61,40.64 54.61,38.35 C4.2 54.61,38.1 54.61,36.83 | 47.75,20.07 U$2.2 47.75,19.81 48.51,19.81 48.51,18.54 48.01,18.03 46.23,18.03 | 45.97,18.03 44.7,18.03 C11.2 | 45.97,18.03 46.23,18.03 | 53.59,17.02 55.12,18.54 C13.2 55.37,18.54 56.39,19.56 56.39,21.34 51.82,25.91 51.82,36.83 54.61,36.83 | 53.59,17.02 52.83,17.02 R4.1 53.59,17.02 | 47.75,5.33 47.75,6.1 46.48,7.37 46.48,7.62 U4.5 46.48,7.87 46.48,8.13 45.97,8.64 45.97,18.03 | 47.75,5.33 47.75,2.03 U4.14 47.75,1.78 47.5,1.52 47.5,1.27 v42.93,1.27 33.78,1.27 33.78,9.4 SV2.3 33.53,9.65 33.53,19.3 12.95,19.3 | 47.75,5.33 53.59,5.33 C18.2 53.85,5.33 54.86,6.35 v54.86,9.91 v54.86,12.45 54.86,15.75 53.59,17.02 | 46.48,33.02 45.72,33.02 U$4.35 | 46.48,33.02 46.48,35.56 46.23,35.81 | 46.23,35.81 45.72,35.81 U$4.39 46.23,35.81 | 44.45,40.39 44.45,45.47 44.7,45.72 44.7,46.48 45.72,47.5 C7.2 45.72,47.75 45.47,52.32 44.45,52.32 C10.2
  Top 0.152: 44.45,40.39 44.45,38.61 U$4.44 | 46.23,35.81 46.74,36.32 46.74,38.1 44.45,40.39 | C2.2 34.29,49.28 36.07,49.28 C1.2 36.32,49.02 37.34,49.02 37.34,38.86 U$4.6 37.34,38.61 37.34,37.85 40.64,34.54 | U$4.25 41.4,29.72 40.89,29.72 U$4.24 40.64,29.72 40.64,34.54 | 40.64,34.54 44.96,30.23 44.96,29.46 U$4.30 45.21,29.46 46.23,29.46 | 46.48,33.02 46.74,32.77 46.74,29.97 46.23,29.46 | 46.23,29.46 46.23,18.03 | 12.95,19.3 12.95,23.37 C16.2 13.21,23.62 13.97,24.38 13.97,39.12 14.48,39.62 C15.2 | 12.95,19.3 12.95,4.57 C17.2 | v9.65,44.96 10.92,44.96 U1.5 | v8.13,29.46 9.91,29.46 U2.5
  Top 0.254: v15.24,62.74 15.24,57.15 v15.14,57.15
  Bottom 0.152: 25.91,57.66 25.91,55.12 26.42,54.61 26.67,54.61 27.18,54.1 J1.H36 | 25.91,57.66 27.18,57.66 J1.H39 | 14.63,57.15 13.21,57.15 4.83,65.53 SV1.2 | v15.14,57.15 19.05,57.15 19.56,56.64 J1.C38 | 25.91,59.69 25.91,57.66 | v7.62,10.16 7.37,10.41 5.33,10.41 | 5.33,10.41 3.05,10.41 v2.79,10.67 | v9.65,44.96 11.43,43.18 23.37,43.18 | 25.91,43.18 26.67,43.18 27.18,42.67 J1.H27 | 25.91,43.18 23.37,43.18 | 25.91,43.18 25.91,41.15 26.42,40.64 28.45,40.64 28.45,39.88 27.94,39.37 27.69,39.37 27.18,38.86 J1.H24 | 26.16,45.72 26.67,45.72 27.18,46.23 J1.H30 | 26.16,45.72 25.91,45.47 25.91,43.18 | 26.16,45.72 25.91,45.72 25.91,49.28 26.16,49.53 26.67,49.53 27.18,50.04 J1.H33 | 28.45,11.94 31.24,11.94 33.53,9.65 SV2.3 | 28.45,11.94 27.18,11.94 J1.H3 | 23.37,17.02 23.88,16.51 25.65,16.51 26.16,16 27.18,16 J1.H6 | 23.37,17.02 23.37,19.05 25.91,19.05 | 25.91,19.05 26.67,19.05 27.18,19.56 J1.H9 | 25.91,19.05 25.91,22.61 26.16,22.86 26.67,22.86 27.18,23.37 J1.H12 27.18,23.62 26.67,24.13 26.42,24.13 25.91,24.64 25.91,28.45 | v8.13,29.46 9.14,30.48 25.91,30.48 | 25.91,30.48 26.67,30.48 27.18,30.99 J1.H18 | 25.91,28.45 26.42,27.94 26.67,27.94 27.18,27.43 J1.H15 | 25.91,30.48 25.91,28.45 | 26.16,34.29 26.67,34.29 27.18,34.8 J1.H21 | 26.16,34.29 25.91,34.04 25.91,30.48 | 28.45,11.94 28.45,13.97 23.88,13.97 | 23.88,13.97 23.37,14.48 23.37,17.02 | 23.37,43.18 23.37,34.29 26.16,34.29 | 5.33,10.41 5.33,8.89 13.46,8.89 18.54,13.97 23.88,13.97
  Bottom 0.254: v15.14,57.15 14.63,57.15 | 25.91,59.69 23.9,61.7 23.88,61.7 22.2,63.37 15.88,63.37 v15.24,62.74
  other vias: 13.97,64.52 15.49,64.52 16.76,64.52 18.03,64.52 19.56,64.52 21.08,61.47 19.81,61.47 18.8,61.47 17.27,61.47 17.02,60.2 21.08,64.52 29.21,58.93 29.21,57.4 29.46,51.31 29.46,46.23 29.46,42.42 34.04,46.23 35.05,51.31 32.77,51.31 40.39,52.07 38.35,52.58 41.15,51.05 46.74,49.28 50.04,48.26 50.04,46.48 45.97,53.85 48.77,42.67 46.48,42.67 46.48,40.89 48.77,40.89 48.77,39.12 48.77,37.34 48.77,35.05 48.77,33.27 48.77,31.5 48.77,29.72 48.77,28.19 53.34,28.45 55.88,28.45 55.63,46.99 48.77,26.16 46.99,25.91 49.02,22.86 51.56,19.81 51.31,18.03 48.77,17.27 46.99,17.27 44.96,16.51 42.42,16.51 38.61,27.69 36.32,26.42 33.27,27.43 33.02,31.24 29.72,39.88 29.72,35.05 29.72,31.24 29.72,27.43 29.72,23.62 29.72,20.07 29.72,17.53 29.72,13.97 35.81,13.72 37.59,13.72 34.8,12.19 32.51,13.97 35.05,5.33 38.35,5.59 39.62,2.03 36.58,2.03 34.8,2.03 32.77,2.03 32.77,5.08 18.54,1.78 16.51,1.78 13.97,1.78 11.43,1.78 14.99,4.32 18.03,4.32 13.97,6.6 13.97,12.7 7.87,5.84 12.19,29.21 12.19,25.15 14.99,24.38 7.87,24.38 12.7,32.77 2.54,32.26 1.52,26.16 14.99,47.24 12.7,48.77 12.7,51.31 2.54,46.48 12.7,52.83 13.97,60.2 13.97,62.48
  pour Top: 0.25,70.1 57.4,70.1 57.4,0.25 0.25,0.25
IRIS_IN_A  (via drill 0.33)
  Top 0.152: v6.86,42.42 6.86,44.45 5.33,44.45 U1.13
  Bottom 0.152: v6.86,42.42 10.41,38.86 18.03,38.86 18.8,38.1 20.57,38.1 20.83,37.85 20.83,36.32 19.56,36.32 J1.C22
IRIS_IN_A#  (via drill 0.33)
  Top 0.152: v4.06,44.45 4.06,44.96 5.08,44.96 U1.12
  Bottom 0.152: v4.06,44.45 4.06,38.35 18.03,38.35 18.8,37.59 19.56,37.59 J1.C23
IRIS_IN_B  (via drill 0.33)
  Top 0.152: v4.06,46.23 5.08,46.23 U1.10
  Bottom 0.152: v4.06,46.23 8.89,41.4 19.56,41.4 J1.C26
IRIS_IN_B#  (via drill 0.33)
  Top 0.152: v5.33,47.75 5.33,46.99 U1.9
  Bottom 0.152: v5.33,47.75 10.41,42.67 19.56,42.67 J1.C27
LINE_VALID  (via drill 0.33)
  Top 0.152: v44.45,22.35 44.45,29.46 U$4.29
  Bottom 0.152: v44.45,22.35 40.13,18.54 27.18,18.54 J1.H8
N$1  (via drill 0.33)
  Top 0.152: 12.19,43.69 19.05,43.69 19.05,43.43 19.81,42.67 20.32,42.67 X2.1 | 12.19,43.69 11.18,43.69 U1.3 | 12.19,43.69 v12.19,45.21
  Bottom 0.152: v12.19,45.21 8.38,49.02 5.59,49.02 2.79,51.82 X3.1
N$2  (via drill 0.33)
  Top 0.152: U1.4 10.92,44.45 10.16,44.45 9.91,44.2 8.64,44.2 8.64,45.21 6.6,47.24 6.6,50.55 5.33,51.82 X3.2 | v18.03,50.29 21.59,46.74 21.59,43.94 20.57,43.94 X2.2
  Bottom 0.152: v18.03,50.29 17.78,50.04 7.11,50.04 5.33,51.82 X3.2
N$3
  Top 0.152: X3.3 7.87,51.82 8.64,51.05 8.64,45.72 10.92,45.72 U1.6 11.18,45.72 11.43,45.72 11.68,45.97 12.45,45.97 12.95,45.47 12.95,45.21 20.32,45.21 X2.3
N$4  (via drill 0.33)
  Top 0.152: U2.3 9.91,28.19 6.6,28.19 6.6,32.77 2.79,36.58 X5.1 | v14.73,32.51 14.73,28.45 20.07,28.45 X4.1
  Bottom 0.152: v14.73,32.51 13.46,33.78 5.59,33.78 2.79,36.58 X5.1
N$5  (via drill 0.33)
  Top 0.152: U2.4 9.91,28.7 7.11,28.7 7.11,34.8 5.33,36.58 X5.2 | v16.51,32.51 16.51,29.72 20.07,29.72 X4.2
  Bottom 0.152: v16.51,32.51 14.73,34.29 7.62,34.29 5.33,36.58 X5.2
N$6  (via drill 0.33)
  Top 0.152: U2.6 9.91,29.97 8.64,29.97 8.64,35.81 7.87,36.58 X5.3 | v17.53,32.51 17.53,32.26 20.07,32.26 X4.4
  Bottom 0.152: v17.53,32.51 15.24,34.8 9.65,34.8 7.87,36.58 X5.3
N$7  (via drill 0.33)
  Top 0.152: U2.7 9.91,30.73 9.14,30.73 9.14,35.56 10.16,36.58 X5.4 | v17.02,36.58 20.07,33.53 X4.5
  Bottom 0.152: X5.4 v17.02,36.58
N$8  (via drill 0.33)
  Top 0.152: 19.81,11.43 19.81,11.94 20.07,12.19 X6.1 | 19.81,11.43 19.81,3.3 10.67,3.3 9.4,4.57 9.4,8.64 10.16,8.64 U3.3 | 19.81,11.43 v17.02,14.22
  Bottom 0.152: v17.02,14.22 2.79,14.22 2.79,17.02 X7.1
N$9
  Top 0.152: 8.89,9.4 6.86,9.4 6.86,15.49 5.33,17.02 X7.2 | 8.89,9.4 10.16,9.4 U3.4 | 8.89,9.4 8.89,2.79 19.81,2.79 21.59,4.57 21.59,13.46 20.32,13.46 X6.2
N$10  (via drill 0.33)
  Top 0.152: U3.6 10.16,10.67 8.13,10.67 8.13,11.43 7.87,11.68 7.87,17.02 X7.3 | v15.75,17.53 20.07,17.53 X6.5
  Bottom 0.152: v15.75,17.53 13.97,19.3 9.91,19.3 7.87,17.27 X7.3
N$11  (via drill 0.33)
  Top 0.152: U3.7 10.16,11.43 9.65,11.43 9.4,11.18 8.64,11.18 8.64,11.43 8.38,11.68 8.38,15.24 10.16,17.02 X7.4 | v13.72,18.54 20.07,18.54 X6.6
  Bottom 0.152: v13.72,18.54 12.45,17.27 10.41,17.27 X7.4
N$15
  Top 0.152: U1.15 5.08,43.18 3.3,43.18 C19.2
N$16
  Top 0.152: U1.16 5.08,42.42 4.32,42.42 3.3,41.4 C19.1
N$17
  Top 0.152: U1.1 11.18,42.42 12.95,40.64 12.95,39.88 C15.1
N$18
  Top 0.152: U2.15 4.06,27.43 2.54,27.43 2.54,24.64 C20.2
N$19
  Top 0.152: U2.16 4.06,26.67 3.56,26.16 3.56,23.62 2.54,22.61 C20.1
N$20
  Top 0.152: U2.1 10.16,26.67 11.18,25.65 11.18,23.62 C16.1
N$21  (via drill 0.33)
  Top 0.152: v5.59,8.13 4.57,8.13 U3.15 | v2.29,9.91 2.03,9.65 C21.2
  Bottom 0.152: v5.59,8.13 3.81,9.91 v2.29,9.91
N$22
  Top 0.152: U3.16 4.57,7.37 6.1,5.84 6.1,1.27 5.84,1.02 0.51,1.02 0.51,5.33 2.03,6.86 C21.1
N$23
  Top 0.152: U3.1 10.41,7.37 11.18,6.6 11.18,4.57 C17.1
N$27
  Top 0.152: 11.68,46.48 20.32,46.48 X2.4 | 11.68,46.48 11.18,46.48 U1.7 | 11.68,46.48 11.68,50.55 10.41,51.82 X3.4
N$29
  Top 0.152: U4.15 48.51,1.78 48.51,1.52 48.77,1.27 53.59,1.27 C22.2
N$36
  Top 0.152: U4.16 49.02,2.03 52.58,2.03 53.59,3.05 C22.1
N$37
  Top 0.152: 52.83,19.05 50.04,19.05 U$2.4 | 52.83,19.05 R3.1 | 52.83,19.05 R4.2
N$38
  Bottom 0.152: J1.C37 19.56,55.37 19.05,55.88 11.94,55.88 4.83,62.99 SV1.3
N$39
  Bottom 0.152: J1.C36 19.56,54.1 6.6,54.1 3.05,57.66 3.05,60.45 4.57,60.45 SV1.4
N$40  (via drill 0.33)
  Top 0.152: v50.29,49.78 50.29,50.8 50.04,51.05 U$3.4 | v51.82,48.26 51.56,48.51 51.56,50.04 52.83,51.31 R6.2 R5.1
  Bottom 0.152: v51.82,48.26 v50.29,49.78
N$41
  Bottom 0.152: J1.C35 19.56,52.83 20.07,53.34 20.32,53.34 20.83,53.85 20.83,54.61 8.13,54.61 4.83,57.91 SV1.5
N$46
  Top 0.152: U4.1 49.02,7.62 53.59,7.62 53.59,7.11 C18.1
N$47
  Top 0.152: X1.1 51.82,12.19 47.75,8.13 47.75,7.87 U4.3
N$48
  Top 0.152: U4.4 46.99,7.87 47.24,8.13 47.24,9.91 49.53,12.19 X1.2
N$49  (via drill 0.33)
  Top 0.152: v45.72,6.6 45.72,7.62 U4.6
  Bottom 0.152: v45.72,6.6 45.72,12.19 X1.3
N$50
  Top 0.152: U4.7 44.96,7.87 44.96,11.94 44.7,12.19 X1.4
N$121
  pour Bottom: 0.51,70.1 57.4,70.1 57.4,0.51 0.51,0.51
OE_BAR  (via drill 0.33)
  Top 0.152: v40.13,27.43 40.13,29.46 U$4.23
  Bottom 0.152: v40.13,27.43 36.58,24.89 27.18,24.89 J1.H13
PIXCLK  (via drill 0.33)
  Top 0.152: v33.53,33.53 36.58,33.53 U$4.13
  Bottom 0.152: v33.53,33.53 32.51,32.51 27.18,32.51 J1.H19
RESET_BAR  (via drill 0.33)
  Top 0.152: v35.81,28.19 35.81,28.96 35.56,29.21 35.56,30.73 36.58,30.73 U$4.17
  Bottom 0.152: v35.81,28.19 33.78,26.16 27.18,26.16 J1.H14
SCLK  (via drill 0.33)
  Top 0.152: 35.31,17.78 35.56,17.53 R2.1 35.31,17.78 | 35.31,17.78 34.29,18.8 v34.29,29.97 34.29,32.26 36.58,32.26 U$4.15 | 35.31,17.78 34.04,16.51 34.04,11.68 36.07,9.65 SV2.2
  Bottom 0.152: v34.29,29.97 27.18,29.97 J1.H17
SDATA  (via drill 0.33)
  Top 0.152: 36.83,11.43 38.61,9.65 SV2.1 | 36.83,11.43 34.54,13.72 34.54,16.51 36.58,16.51 36.83,16.76 36.83,18.29 35.05,20.07 v35.05,28.7 35.05,31.5 36.58,31.5 U$4.16 | 36.83,11.43 39.88,14.48 39.88,17.27 38.86,17.27 R1.1
  Bottom 0.152: v35.05,28.7 27.18,28.7 J1.H16
SPARE_OUT1  (via drill 0.33)
  Top 0.152: v46.99,3.3 46.99,2.03 U4.13
  Bottom 0.152: v46.99,3.3 39.88,10.41 39.88,15.24 25.15,15.24 24.64,15.75 J1.G6
SPARE_OUT2  (via drill 0.33)
  Top 0.152: v46.23,5.08 46.23,2.29 46.48,2.03 U4.12
  Bottom 0.152: v46.23,5.08 40.39,10.92 40.39,16.51 26.16,16.51 25.65,17.02 24.64,17.02 J1.G7
SPARE_OUT3  (via drill 0.33)
  Top 0.152: v40.89,6.6 44.96,2.54 44.96,2.03 U4.10
  Bottom 0.152: v40.89,6.6 31.75,6.6 28.19,10.16 20.07,10.16 19.56,10.67 J1.C2
SPARE_OUT4  (via drill 0.33)
  Top 0.152: v39.12,7.37 44.45,2.03 U4.9
  Bottom 0.152: v39.12,7.37 38.86,7.62 32,7.62 28.19,11.43 20.07,11.43 19.56,11.94 J1.C3
TRIGGER  (via drill 0.33)
  Top 0.152: v42.93,27.94 42.93,29.46 U$4.27
  Bottom 0.152: v42.93,27.94 36.83,22.35 27.18,22.35 J1.H11
VADJ  (via drill 0.33)
  Top 0.152: v28.96,60.71 29.97,62.23 TP1.TP
  Bottom 0.152: v28.96,60.71 27.43,59.18 27.18,59.18 J1.H40
ZOOM_IN_A  (via drill 0.33)
  Top 0.152: v5.33,28.7 4.32,28.7 U2.13
  Bottom 0.152: v5.33,28.7 7.87,26.16 19.56,26.16 J1.C14
ZOOM_IN_A#  (via drill 0.33)
  Top 0.152: v5.84,29.46 4.32,29.46 U2.12
  Bottom 0.152: v5.84,29.46 7.87,27.43 19.56,27.43 J1.C15
ZOOM_IN_B  (via drill 0.33)
  Top 0.152: v5.84,30.73 4.32,30.73 U2.10
  Bottom 0.152: v5.84,30.73 6.1,30.99 19.56,30.99 J1.C18
ZOOM_IN_B#  (via drill 0.33)
  Top 0.152: v5.33,31.5 4.32,31.5 U2.9
  Bottom 0.152: v5.33,31.5 5.59,31.75 19.05,31.75 19.56,32.26 J1.C19

### Text on the board
tPlace: ZedImgBoard 2.0